# Altium schematic sheet RGMII USB.SchDoc: C-F-U-Bridge
size A3; ApprovedBy: Luca Schenetti; CheckedBy: Luca Schenetti; Author: Luca Schenetti; CompanyName: Luca Schenetti; DrawnBy: Luca Schenetti; Engineer: Luca Schenetti; Revision: A; SheetNumber: 5; SheetTotal: 7
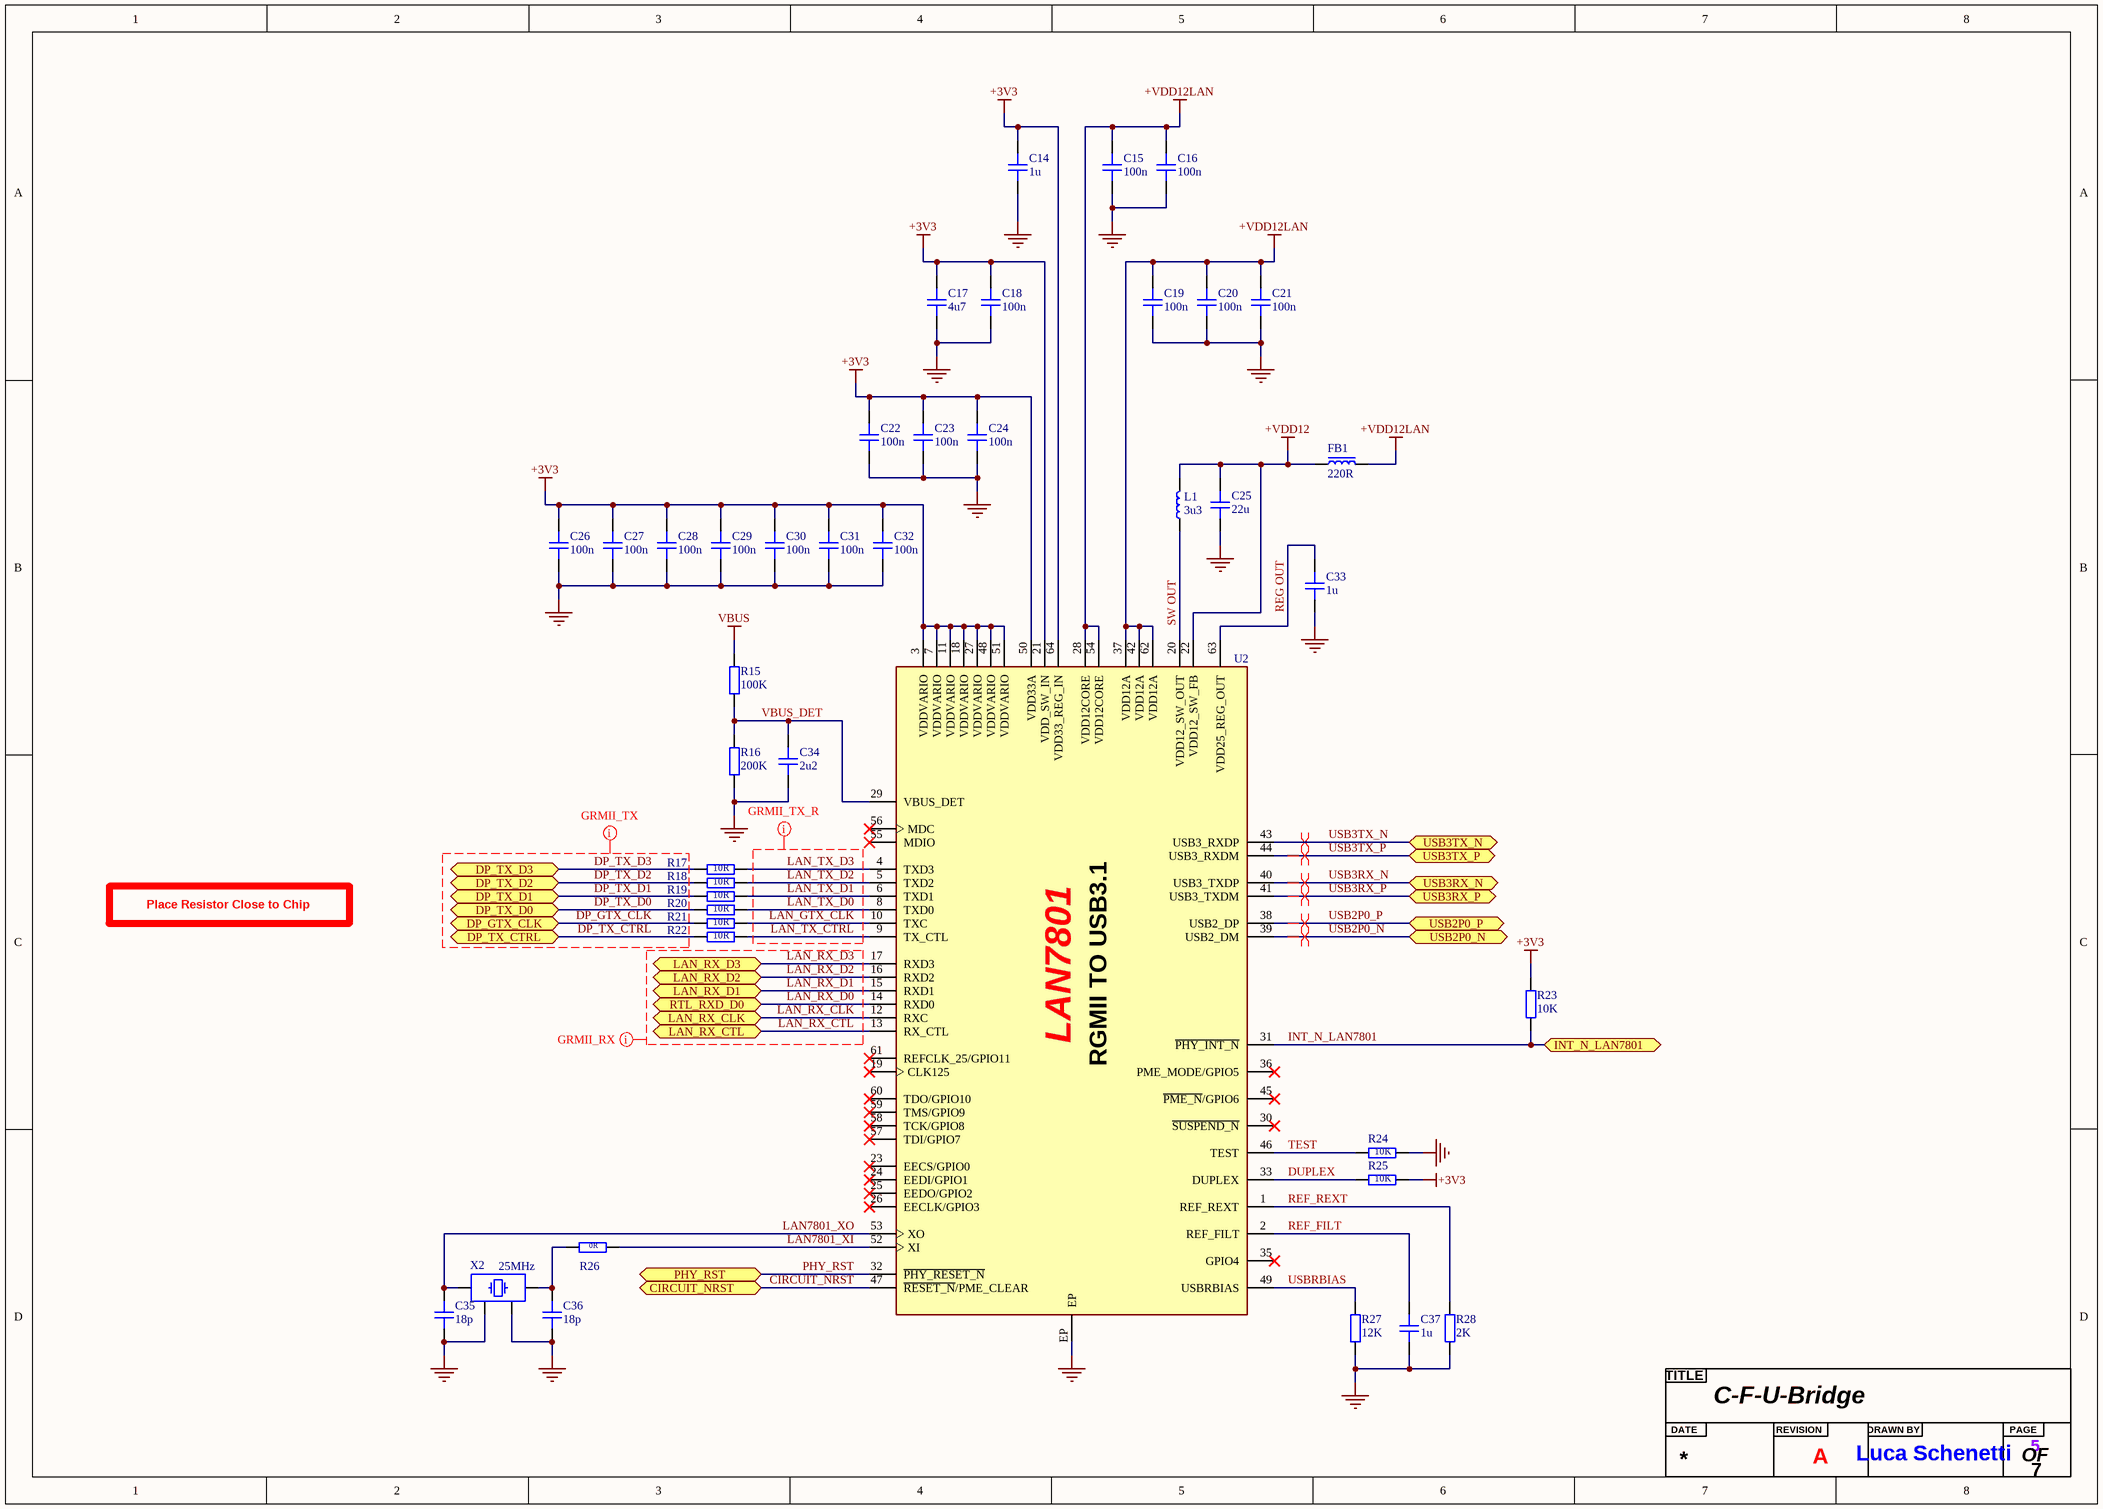
[diagram p0: RGMII USB.SchDoc]

## Parts
?  Title  (value not drawn)  (graphical)
C14  1u  [CAP_0603]
C15  100n  [CAP_0603]
C16  100n  [CAP_0603]
C17  4u7  [CAP_0603]
C18  100n  [CAP_0603]
C19  100n  [CAP_0603]
C20  100n  [CAP_0603]
C21  100n  [CAP_0603]
C22  100n  [CAP_0603]
C23  100n  [CAP_0603]
C24  100n  [CAP_0603]
C25  22u  [CAP_0603]
C26  100n  [CAP_0603]
C27  100n  [CAP_0603]
C28  100n  [CAP_0603]
C29  100n  [CAP_0603]
C30  100n  [CAP_0603]
C31  100n  [CAP_0603]
C32  100n  [CAP_0603]
C33  1u  [CAP_0603]
C34  2u2  [CAP_0603]
C35  18p  [CAP_0402]
C36  18p  [CAP_0402]
C37  1u  [CAP_0603]
FB1  220R  [FB_0603]
L1  3u3  [IND_0603]
R15  100K  [RES_0603]
R16  200K  [RES_0603]
R17  10R  [RES_0402]
R18  10R  [RES_0402]
R19  10R  [RES_0402]
R20  10R  [RES_0402]
R21  10R  [RES_0402]
R22  10R  [RES_0402]
R23  10K  [RES_0402]
R24  10K  [RES_0603]
R25  10K  [RES_0603]
R26  0R  [RES_0402]
R27  12K  [RES_0603]
R28  2K  [RES_0603]
U2  USB 3.1 TO RGMII  [LAN7801-I/9JX]  (value not drawn)
X2  25MHz  [XTAL_3225]

## Ports
CIRCUIT_NRST (bidir, see PHY SFC[2C], STM32 MCU[7A]), DP_GTX_CLK (bidir, see PHY SFC[3B]), DP_TX_CTRL (bidir, see PHY SFC[3B]), DP_TX_D0 (bidir, see PHY SFC[3B]), DP_TX_D1 (bidir, see PHY SFC[3B]), DP_TX_D2 (bidir, see PHY SFC[3B]), DP_TX_D3 (bidir, see PHY SFC[3B]), INT_N_LAN7801 (bidir, see STM32 MCU[4C]), LAN_RX_CLK (bidir, see PHY SFC[2B]), LAN_RX_CTL (bidir, see PHY SFC[2C]), LAN_RX_D1 (bidir, see PHY SFC[2C]), LAN_RX_D2 (bidir, see PHY SFC[2C]), LAN_RX_D3 (bidir, see PHY SFC[2C]), PHY_RST (bidir, see PHY SFC[3C]), RTL_RXD_D0 (bidir, see PHY SFC[2B]), USB2P0_N (bidir, see USB RGMII CONN[6B]), USB2P0_P (bidir, see USB RGMII CONN[6B]), USB3RX_N (bidir, see USB RGMII CONN[2B]), USB3RX_P (bidir, see USB RGMII CONN[2B]), USB3TX_N (bidir, see USB RGMII CONN[2B]), USB3TX_P (bidir, see USB RGMII CONN[2B])

## Nets
+3V3: C14.2 C17.2 C18.2 C22.2 C23.2 C24.2 C26.2 C27.2 C28.2 C29.2 C30.2 C31.2 C32.2 R23.2 R25.2 U2.3(VDDVARIO) U2.7(VDDVARIO) U2.11(VDDVARIO) U2.18(VDDVARIO) U2.21(VDD_SW_IN) U2.27(VDDVARIO) U2.48(VDDVARIO) U2.50(VDD33A) U2.51(VDDVARIO) U2.64(VDD33_REG_IN)
+VDD12: C25.2 FB1.1 L1.2 U2.22(VDD12_SW_FB)
+VDD12LAN: C15.2 C16.2 C19.2 C20.2 C21.2 FB1.2 U2.28(VDD12CORE) U2.37(VDD12A) U2.42(VDD12A) U2.54(VDD12CORE) U2.62(VDD12A)
GND: C14.1 C15.1 C16.1 C17.1 C18.1 C19.1 C20.1 C21.1 C22.1 C23.1 C24.1 C25.1 C26.1 C27.1 C28.1 C29.1 C30.1 C31.1 C32.1 C33.1 C34.1 C35.1 C36.1 C37.1 R16.1 R24.2 R27.1 R28.1 U2.EP X2.2 X2.4
VBUS: R15.2
CIRCUIT_NRST: U2.47(~{RESET_N}/PME_CLEAR) ; port CIRCUIT_NRST
DP_GTX_CLK: R21.1 ; port DP_GTX_CLK
DP_TX_CTRL: R22.1 ; port DP_TX_CTRL
DP_TX_D0: R20.1 ; port DP_TX_D0
DP_TX_D1: R19.1 ; port DP_TX_D1
DP_TX_D2: R18.1 ; port DP_TX_D2
DP_TX_D3: R17.1 ; port DP_TX_D3
DUPLEX: R25.1 U2.33(DUPLEX)
INT_N_LAN7801: R23.1 U2.31(~{PHY_INT_N}) ; port INT_N_LAN7801
LAN7801_XI: R26.2 U2.52(XI)
LAN7801_XO: C35.2 U2.53(XO) X2.3
LAN_GTX_CLK: R21.2 U2.10(TXC)
LAN_RX_CLK: U2.12(RXC) ; port LAN_RX_CLK
LAN_RX_CTL: U2.13(RX_CTL) ; port LAN_RX_CTL
LAN_RX_D0: U2.14(RXD0) ; port RTL_RXD_D0
LAN_RX_D1: U2.15(RXD1) ; port LAN_RX_D1
LAN_RX_D2: U2.16(RXD2) ; port LAN_RX_D2
LAN_RX_D3: U2.17(RXD3) ; port LAN_RX_D3
LAN_TX_CTRL: R22.2 U2.9(TX_CTL)
LAN_TX_D0: R20.2 U2.8(TXD0)
LAN_TX_D1: R19.2 U2.6(TXD1)
LAN_TX_D2: R18.2 U2.5(TXD2)
LAN_TX_D3: R17.2 U2.4(TXD3)
PHY_RST: U2.32(~{PHY_RESET_N}) ; port PHY_RST
REF_FILT: C37.2 U2.2(REF_FILT)
REF_REXT: R28.2 U2.1(REF_REXT)
REG OUT: C33.2 U2.63(VDD25_REG_OUT)
SW OUT: L1.1 U2.20(VDD12_SW_OUT)
TEST: R24.1 U2.46(TEST)
USB2P0_N: U2.39(USB2_DM) ; port USB2P0_N
USB2P0_P: U2.38(USB2_DP) ; port USB2P0_P
USB3RX_N: U2.40(USB3_TXDP) ; port USB3RX_N
USB3RX_P: U2.41(USB3_TXDM) ; port USB3RX_P
USB3TX_N: U2.43(USB3_RXDP) ; port USB3TX_N
USB3TX_P: U2.44(USB3_RXDM) ; port USB3TX_P
USBRBIAS: R27.2 U2.49(USBRBIAS)
VBUS_DET: C34.2 R15.1 R16.2 U2.29(VBUS_DET)
NetC36_2: C36.2 R26.1 X2.1

Not connected (* = marked no-connect by the designer): U2 19(CLK125)* 23(EECS/GPIO0)* 24(EEDI/GPIO1)* 25(EEDO/GPIO2)* 26(EECLK/GPIO3)* 30(~{SUSPEND_N})* 35(GPIO4)* 36(PME_MODE/GPIO5)* 45(~{PME_N}/GPIO6)* 55(MDIO)* 56(MDC)* 57(TDI/GPIO7)* 58(TCK/GPIO8)* 59(TMS/GPIO9)* 60(TDO/GPIO10)* 61(REFCLK_25/GPIO11)*

## Layout directives
differential pair; differential pair class DIFF_USB_90Ω; rule Matched Net Lengths [Delay Tolerance = 5ps]: USB3RX_N, USB3RX_P, USB3TX_N, USB3TX_P
net class GRMII_TX_R; rule Matched Net Lengths [Delay Tolerance = 20ps]: LAN_GTX_CLK, LAN_TX_CTRL, LAN_TX_D0, LAN_TX_D1, LAN_TX_D2, LAN_TX_D3
net class GRMII_TX; rule Matched Net Lengths [Delay Tolerance = 20ps]: DP_GTX_CLK, DP_TX_CTRL, DP_TX_D0, DP_TX_D1, DP_TX_D2, DP_TX_D3
net class GRMII_RX; rule Matched Net Lengths [Delay Tolerance = 20ps]: LAN_RX_CLK, LAN_RX_CTL, LAN_RX_D0, LAN_RX_D1, LAN_RX_D2, LAN_RX_D3
differential pair; differential pair class DIFF_USB_90Ω; rule Matched Net Lengths [Delay Tolerance = 100ps]: USB2P0_N, USB2P0_P

## Notes on the sheet
- Place Resistor Close to Chip
- (in symbol LAN7801-I/9JX) LAN7801; RGMII TO USB3.1
- (in symbol Title) TITLE; DATE; REVISION; DRAWN BY; PAGE; OF

## Library data of the parts
C14 C33 C37 = CAP_0603: [C15849]; Manufacturer: *; Manufacturer Part Number: *; Distributor Link: *; LCSC: *; Rating: *; Dielectric: *
C15 C16 C18-C24 C26-C32 = CAP_0603: [C14663]; Manufacturer: *; Manufacturer Part Number: *; Distributor Link: *; LCSC: *; Rating: *; Dielectric: *
C17 = CAP_0603: [C19666]; Manufacturer: *; Manufacturer Part Number: *; Distributor Link: *; LCSC: *; Rating: *; Dielectric: *
C25 = CAP_0603: [C59461]; Manufacturer: *; Manufacturer Part Number: *; Distributor Link: *; LCSC: *; Rating: *; Dielectric: *
C34 = CAP_0603: [C23630]; Manufacturer: *; Manufacturer Part Number: *; Distributor Link: *; LCSC: *; Rating: *; Dielectric: *
C35 C36 = CAP_0402: Capacitor SMD 0402 [C1549]; Manufacturer: *; Manufacturer Part Number: *; Distributor Link: *; LCSC: *; Rating: *; Dielectric: *
FB1 = FB_0603: [C88980]; Manufacturer: *; Manufacturer Part Number: *; Distributor Link: *; LCSC: *
L1 = IND_0603: [C281110]
R15 = RES_0603: [C25803]; Manufacturer: *; Manufacturer Part Number: *; Distributor Link: *; LCSC: *
R16 = RES_0603: [C25811]; Manufacturer: *; Manufacturer Part Number: *; Distributor Link: *; LCSC: *
R17-R22 = RES_0402: [C25077]; Manufacturer: *; Manufacturer Part Number: *; Distributor Link: *; LCSC: *
R23 = RES_0402: [C25744]; Manufacturer: *; Manufacturer Part Number: *; Distributor Link: *; LCSC: *
R24 R25 = RES_0603: [C25804]; Manufacturer: *; Manufacturer Part Number: *; Distributor Link: *; LCSC: *
R26 = RES_0402: Resistor SMD 0402 [C17168]; Manufacturer: *; Manufacturer Part Number: *; Distributor Link: *; LCSC: *
R27 = RES_0603: [C22790]; Manufacturer: *; Manufacturer Part Number: *; Distributor Link: *; LCSC: *
R28 = RES_0603: [C22975]; Manufacturer: *; Manufacturer Part Number: *; Distributor Link: *; LCSC: *
U2 = LAN7801-I/9JX: [C633491]
X2 = TSX-3225_24.0000MF15X-AC: Crystal SMD 24MHz 10PPM 7pF 3225 [C9006]; Manufacturer: Epson; Manufacturer Part Number: TSX-3225 24.0000MF15X-AC